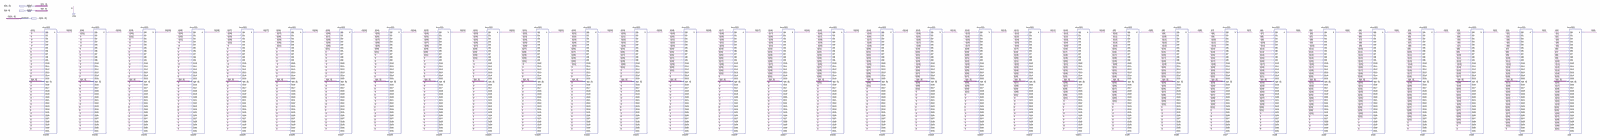
[diagram p0: schematic sheet, whole]
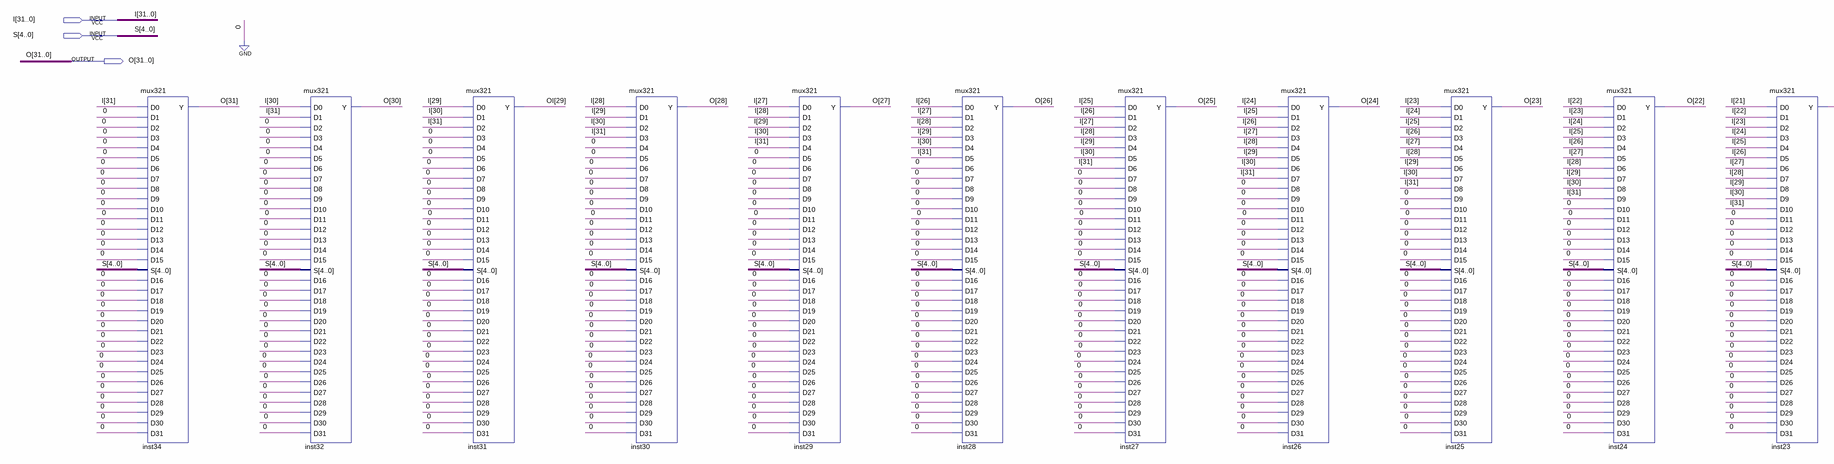
[diagram p1: schematic sheet, left part]
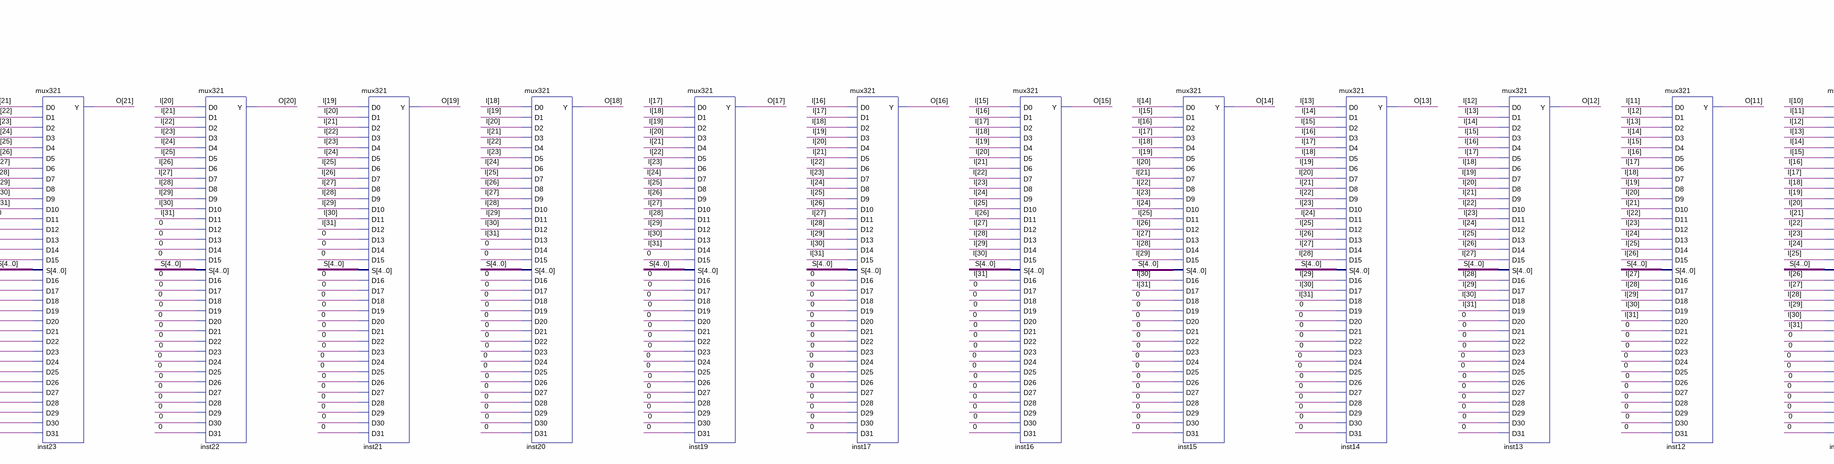
[diagram p2: schematic sheet, centre part]
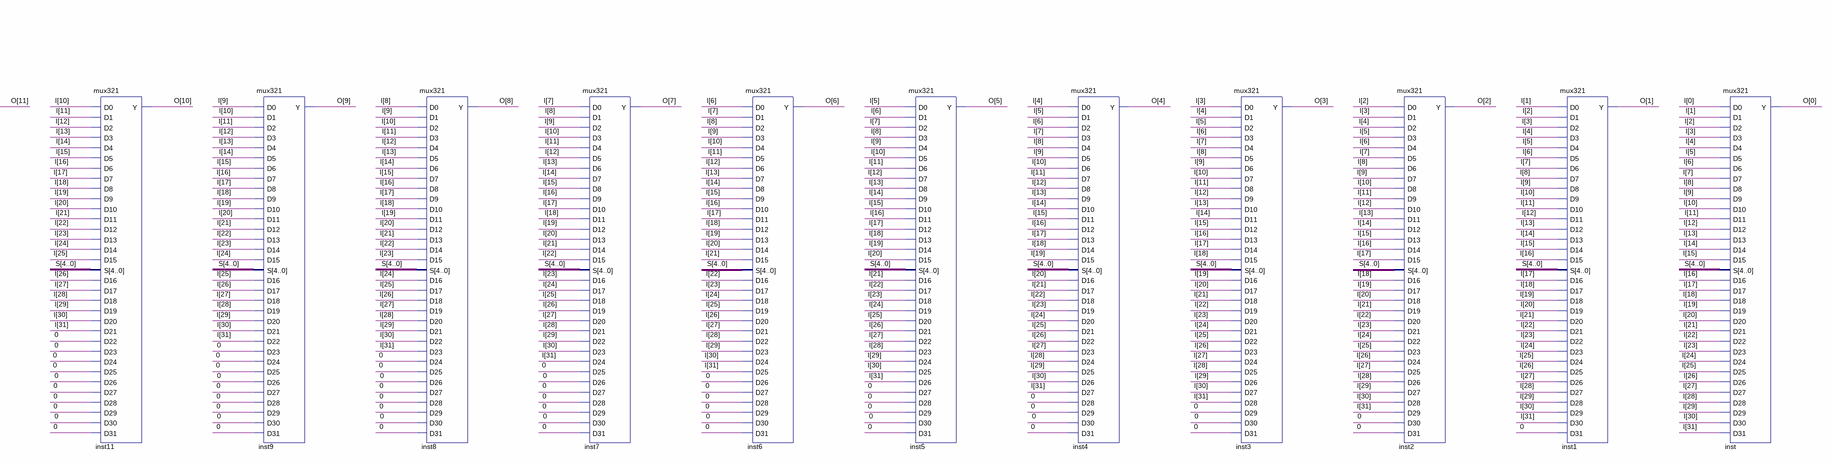
[diagram p3: schematic sheet, right part]
// Quartus schematic Shift_Right_32b.bdf as structural Verilog: 32 symbols, 3 pins
module Shift_Right_32b (
  input  [31:0] I,
  input  [4:0] S,
  output [31:0] O
);

  wire [29:29] OI;

  mux321 inst34 (
    .D0(I[31]), .D1(1'b0), .D2(1'b0), .D3(1'b0), .D4(1'b0), .D5(1'b0), .D6(1'b0), .D7(1'b0), .D8(1'b0),
    .D9(1'b0), .D10(1'b0), .D11(1'b0), .D12(1'b0), .D13(1'b0), .D14(1'b0), .D15(1'b0), .S(S), .D16(1'b0),
    .D17(1'b0), .D18(1'b0), .D19(1'b0), .D20(1'b0), .D21(1'b0), .D22(1'b0), .D23(1'b0), .D24(1'b0),
    .D25(1'b0), .D26(1'b0), .D27(1'b0), .D28(1'b0), .D29(1'b0), .D30(1'b0), .D31(1'b0), .Y(O[31]));
  mux321 inst32 (
    .D0(I[30]), .D1(I[31]), .D2(1'b0), .D3(1'b0), .D4(1'b0), .D5(1'b0), .D6(1'b0), .D7(1'b0), .D8(1'b0),
    .D9(1'b0), .D10(1'b0), .D11(1'b0), .D12(1'b0), .D13(1'b0), .D14(1'b0), .D15(1'b0), .S(S), .D16(1'b0),
    .D17(1'b0), .D18(1'b0), .D19(1'b0), .D20(1'b0), .D21(1'b0), .D22(1'b0), .D23(1'b0), .D24(1'b0),
    .D25(1'b0), .D26(1'b0), .D27(1'b0), .D28(1'b0), .D29(1'b0), .D30(1'b0), .D31(1'b0), .Y(O[30]));
  mux321 inst31 (
    .D0(I[29]), .D1(I[30]), .D2(I[31]), .D3(1'b0), .D4(1'b0), .D5(1'b0), .D6(1'b0), .D7(1'b0), .D8(1'b0),
    .D9(1'b0), .D10(1'b0), .D11(1'b0), .D12(1'b0), .D13(1'b0), .D14(1'b0), .D15(1'b0), .S(S), .D16(1'b0),
    .D17(1'b0), .D18(1'b0), .D19(1'b0), .D20(1'b0), .D21(1'b0), .D22(1'b0), .D23(1'b0), .D24(1'b0),
    .D25(1'b0), .D26(1'b0), .D27(1'b0), .D28(1'b0), .D29(1'b0), .D30(1'b0), .D31(1'b0), .Y(OI[29]));
  mux321 inst30 (
    .D0(I[28]), .D1(I[29]), .D2(I[30]), .D3(I[31]), .D4(1'b0), .D5(1'b0), .D6(1'b0), .D7(1'b0), .D8(1'b0),
    .D9(1'b0), .D10(1'b0), .D11(1'b0), .D12(1'b0), .D13(1'b0), .D14(1'b0), .D15(1'b0), .S(S), .D16(1'b0),
    .D17(1'b0), .D18(1'b0), .D19(1'b0), .D20(1'b0), .D21(1'b0), .D22(1'b0), .D23(1'b0), .D24(1'b0),
    .D25(1'b0), .D26(1'b0), .D27(1'b0), .D28(1'b0), .D29(1'b0), .D30(1'b0), .D31(1'b0), .Y(O[28]));
  mux321 inst29 (
    .D0(I[27]), .D1(I[28]), .D2(I[29]), .D3(I[30]), .D4(I[31]), .D5(1'b0), .D6(1'b0), .D7(1'b0), .D8(1'b0),
    .D9(1'b0), .D10(1'b0), .D11(1'b0), .D12(1'b0), .D13(1'b0), .D14(1'b0), .D15(1'b0), .S(S), .D16(1'b0),
    .D17(1'b0), .D18(1'b0), .D19(1'b0), .D20(1'b0), .D21(1'b0), .D22(1'b0), .D23(1'b0), .D24(1'b0),
    .D25(1'b0), .D26(1'b0), .D27(1'b0), .D28(1'b0), .D29(1'b0), .D30(1'b0), .D31(1'b0), .Y(O[27]));
  mux321 inst28 (
    .D0(I[26]), .D1(I[27]), .D2(I[28]), .D3(I[29]), .D4(I[30]), .D5(I[31]), .D6(1'b0), .D7(1'b0), .D8(1'b0),
    .D9(1'b0), .D10(1'b0), .D11(1'b0), .D12(1'b0), .D13(1'b0), .D14(1'b0), .D15(1'b0), .S(S), .D16(1'b0),
    .D17(1'b0), .D18(1'b0), .D19(1'b0), .D20(1'b0), .D21(1'b0), .D22(1'b0), .D23(1'b0), .D24(1'b0),
    .D25(1'b0), .D26(1'b0), .D27(1'b0), .D28(1'b0), .D29(1'b0), .D30(1'b0), .D31(1'b0), .Y(O[26]));
  mux321 inst27 (
    .D0(I[25]), .D1(I[26]), .D2(I[27]), .D3(I[28]), .D4(I[29]), .D5(I[30]), .D6(I[31]), .D7(1'b0), .D8(1'b0),
    .D9(1'b0), .D10(1'b0), .D11(1'b0), .D12(1'b0), .D13(1'b0), .D14(1'b0), .D15(1'b0), .S(S), .D16(1'b0),
    .D17(1'b0), .D18(1'b0), .D19(1'b0), .D20(1'b0), .D21(1'b0), .D22(1'b0), .D23(1'b0), .D24(1'b0),
    .D25(1'b0), .D26(1'b0), .D27(1'b0), .D28(1'b0), .D29(1'b0), .D30(1'b0), .D31(1'b0), .Y(O[25]));
  mux321 inst26 (
    .D0(I[24]), .D1(I[25]), .D2(I[26]), .D3(I[27]), .D4(I[28]), .D5(I[29]), .D6(I[30]), .D7(I[31]),
    .D8(1'b0), .D9(1'b0), .D10(1'b0), .D11(1'b0), .D12(1'b0), .D13(1'b0), .D14(1'b0), .D15(1'b0), .S(S),
    .D16(1'b0), .D17(1'b0), .D18(1'b0), .D19(1'b0), .D20(1'b0), .D21(1'b0), .D22(1'b0), .D23(1'b0),
    .D24(1'b0), .D25(1'b0), .D26(1'b0), .D27(1'b0), .D28(1'b0), .D29(1'b0), .D30(1'b0), .D31(1'b0), .Y(O[24]));
  mux321 inst25 (
    .D0(I[23]), .D1(I[24]), .D2(I[25]), .D3(I[26]), .D4(I[27]), .D5(I[28]), .D6(I[29]), .D7(I[30]),
    .D8(I[31]), .D9(1'b0), .D10(1'b0), .D11(1'b0), .D12(1'b0), .D13(1'b0), .D14(1'b0), .D15(1'b0), .S(S),
    .D16(1'b0), .D17(1'b0), .D18(1'b0), .D19(1'b0), .D20(1'b0), .D21(1'b0), .D22(1'b0), .D23(1'b0),
    .D24(1'b0), .D25(1'b0), .D26(1'b0), .D27(1'b0), .D28(1'b0), .D29(1'b0), .D30(1'b0), .D31(1'b0), .Y(O[23]));
  mux321 inst24 (
    .D0(I[22]), .D1(I[23]), .D2(I[24]), .D3(I[25]), .D4(I[26]), .D5(I[27]), .D6(I[28]), .D7(I[29]),
    .D8(I[30]), .D9(I[31]), .D10(1'b0), .D11(1'b0), .D12(1'b0), .D13(1'b0), .D14(1'b0), .D15(1'b0), .S(S),
    .D16(1'b0), .D17(1'b0), .D18(1'b0), .D19(1'b0), .D20(1'b0), .D21(1'b0), .D22(1'b0), .D23(1'b0),
    .D24(1'b0), .D25(1'b0), .D26(1'b0), .D27(1'b0), .D28(1'b0), .D29(1'b0), .D30(1'b0), .D31(1'b0), .Y(O[22]));
  mux321 inst23 (
    .D0(I[21]), .D1(I[22]), .D2(I[23]), .D3(I[24]), .D4(I[25]), .D5(I[26]), .D6(I[27]), .D7(I[28]),
    .D8(I[29]), .D9(I[30]), .D10(I[31]), .D11(1'b0), .D12(1'b0), .D13(1'b0), .D14(1'b0), .D15(1'b0), .S(S),
    .D16(1'b0), .D17(1'b0), .D18(1'b0), .D19(1'b0), .D20(1'b0), .D21(1'b0), .D22(1'b0), .D23(1'b0),
    .D24(1'b0), .D25(1'b0), .D26(1'b0), .D27(1'b0), .D28(1'b0), .D29(1'b0), .D30(1'b0), .D31(1'b0), .Y(O[21]));
  mux321 inst22 (
    .D0(I[20]), .D1(I[21]), .D2(I[22]), .D3(I[23]), .D4(I[24]), .D5(I[25]), .D6(I[26]), .D7(I[27]),
    .D8(I[28]), .D9(I[29]), .D10(I[30]), .D11(I[31]), .D12(1'b0), .D13(1'b0), .D14(1'b0), .D15(1'b0), .S(S),
    .D16(1'b0), .D17(1'b0), .D18(1'b0), .D19(1'b0), .D20(1'b0), .D21(1'b0), .D22(1'b0), .D23(1'b0),
    .D24(1'b0), .D25(1'b0), .D26(1'b0), .D27(1'b0), .D28(1'b0), .D29(1'b0), .D30(1'b0), .D31(1'b0), .Y(O[20]));
  mux321 inst21 (
    .D0(I[19]), .D1(I[20]), .D2(I[21]), .D3(I[22]), .D4(I[23]), .D5(I[24]), .D6(I[25]), .D7(I[26]),
    .D8(I[27]), .D9(I[28]), .D10(I[29]), .D11(I[30]), .D12(I[31]), .D13(1'b0), .D14(1'b0), .D15(1'b0), .S(S),
    .D16(1'b0), .D17(1'b0), .D18(1'b0), .D19(1'b0), .D20(1'b0), .D21(1'b0), .D22(1'b0), .D23(1'b0),
    .D24(1'b0), .D25(1'b0), .D26(1'b0), .D27(1'b0), .D28(1'b0), .D29(1'b0), .D30(1'b0), .D31(1'b0), .Y(O[19]));
  mux321 inst20 (
    .D0(I[18]), .D1(I[19]), .D2(I[20]), .D3(I[21]), .D4(I[22]), .D5(I[23]), .D6(I[24]), .D7(I[25]),
    .D8(I[26]), .D9(I[27]), .D10(I[28]), .D11(I[29]), .D12(I[30]), .D13(I[31]), .D14(1'b0), .D15(1'b0),
    .S(S), .D16(1'b0), .D17(1'b0), .D18(1'b0), .D19(1'b0), .D20(1'b0), .D21(1'b0), .D22(1'b0), .D23(1'b0),
    .D24(1'b0), .D25(1'b0), .D26(1'b0), .D27(1'b0), .D28(1'b0), .D29(1'b0), .D30(1'b0), .D31(1'b0), .Y(O[18]));
  mux321 inst19 (
    .D0(I[17]), .D1(I[18]), .D2(I[19]), .D3(I[20]), .D4(I[21]), .D5(I[22]), .D6(I[23]), .D7(I[24]),
    .D8(I[25]), .D9(I[26]), .D10(I[27]), .D11(I[28]), .D12(I[29]), .D13(I[30]), .D14(I[31]), .D15(1'b0),
    .S(S), .D16(1'b0), .D17(1'b0), .D18(1'b0), .D19(1'b0), .D20(1'b0), .D21(1'b0), .D22(1'b0), .D23(1'b0),
    .D24(1'b0), .D25(1'b0), .D26(1'b0), .D27(1'b0), .D28(1'b0), .D29(1'b0), .D30(1'b0), .D31(1'b0), .Y(O[17]));
  mux321 inst17 (
    .D0(I[16]), .D1(I[17]), .D2(I[18]), .D3(I[19]), .D4(I[20]), .D5(I[21]), .D6(I[22]), .D7(I[23]),
    .D8(I[24]), .D9(I[25]), .D10(I[26]), .D11(I[27]), .D12(I[28]), .D13(I[29]), .D14(I[30]), .D15(I[31]),
    .S(S), .D16(1'b0), .D17(1'b0), .D18(1'b0), .D19(1'b0), .D20(1'b0), .D21(1'b0), .D22(1'b0), .D23(1'b0),
    .D24(1'b0), .D25(1'b0), .D26(1'b0), .D27(1'b0), .D28(1'b0), .D29(1'b0), .D30(1'b0), .D31(1'b0), .Y(O[16]));
  mux321 inst16 (
    .D0(I[15]), .D1(I[16]), .D2(I[17]), .D3(I[18]), .D4(I[19]), .D5(I[20]), .D6(I[21]), .D7(I[22]),
    .D8(I[23]), .D9(I[24]), .D10(I[25]), .D11(I[26]), .D12(I[27]), .D13(I[28]), .D14(I[29]), .D15(I[30]),
    .S(S), .D16(I[31]), .D17(1'b0), .D18(1'b0), .D19(1'b0), .D20(1'b0), .D21(1'b0), .D22(1'b0), .D23(1'b0),
    .D24(1'b0), .D25(1'b0), .D26(1'b0), .D27(1'b0), .D28(1'b0), .D29(1'b0), .D30(1'b0), .D31(1'b0), .Y(O[15]));
  mux321 inst15 (
    .D0(I[14]), .D1(I[15]), .D2(I[16]), .D3(I[17]), .D4(I[18]), .D5(I[19]), .D6(I[20]), .D7(I[21]),
    .D8(I[22]), .D9(I[23]), .D10(I[24]), .D11(I[25]), .D12(I[26]), .D13(I[27]), .D14(I[28]), .D15(I[29]),
    .S(S), .D16(I[30]), .D17(I[31]), .D18(1'b0), .D19(1'b0), .D20(1'b0), .D21(1'b0), .D22(1'b0), .D23(1'b0),
    .D24(1'b0), .D25(1'b0), .D26(1'b0), .D27(1'b0), .D28(1'b0), .D29(1'b0), .D30(1'b0), .D31(1'b0), .Y(O[14]));
  mux321 inst14 (
    .D0(I[13]), .D1(I[14]), .D2(I[15]), .D3(I[16]), .D4(I[17]), .D5(I[18]), .D6(I[19]), .D7(I[20]),
    .D8(I[21]), .D9(I[22]), .D10(I[23]), .D11(I[24]), .D12(I[25]), .D13(I[26]), .D14(I[27]), .D15(I[28]),
    .S(S), .D16(I[29]), .D17(I[30]), .D18(I[31]), .D19(1'b0), .D20(1'b0), .D21(1'b0), .D22(1'b0), .D23(1'b0),
    .D24(1'b0), .D25(1'b0), .D26(1'b0), .D27(1'b0), .D28(1'b0), .D29(1'b0), .D30(1'b0), .D31(1'b0), .Y(O[13]));
  mux321 inst13 (
    .D0(I[12]), .D1(I[13]), .D2(I[14]), .D3(I[15]), .D4(I[16]), .D5(I[17]), .D6(I[18]), .D7(I[19]),
    .D8(I[20]), .D9(I[21]), .D10(I[22]), .D11(I[23]), .D12(I[24]), .D13(I[25]), .D14(I[26]), .D15(I[27]),
    .S(S), .D16(I[28]), .D17(I[29]), .D18(I[30]), .D19(I[31]), .D20(1'b0), .D21(1'b0), .D22(1'b0),
    .D23(1'b0), .D24(1'b0), .D25(1'b0), .D26(1'b0), .D27(1'b0), .D28(1'b0), .D29(1'b0), .D30(1'b0),
    .D31(1'b0), .Y(O[12]));
  mux321 inst12 (
    .D0(I[11]), .D1(I[12]), .D2(I[13]), .D3(I[14]), .D4(I[15]), .D5(I[16]), .D6(I[17]), .D7(I[18]),
    .D8(I[19]), .D9(I[20]), .D10(I[21]), .D11(I[22]), .D12(I[23]), .D13(I[24]), .D14(I[25]), .D15(I[26]),
    .S(S), .D16(I[27]), .D17(I[28]), .D18(I[29]), .D19(I[30]), .D20(I[31]), .D21(1'b0), .D22(1'b0),
    .D23(1'b0), .D24(1'b0), .D25(1'b0), .D26(1'b0), .D27(1'b0), .D28(1'b0), .D29(1'b0), .D30(1'b0),
    .D31(1'b0), .Y(O[11]));
  mux321 inst11 (
    .D0(I[10]), .D1(I[11]), .D2(I[12]), .D3(I[13]), .D4(I[14]), .D5(I[15]), .D6(I[16]), .D7(I[17]),
    .D8(I[18]), .D9(I[19]), .D10(I[20]), .D11(I[21]), .D12(I[22]), .D13(I[23]), .D14(I[24]), .D15(I[25]),
    .S(S), .D16(I[26]), .D17(I[27]), .D18(I[28]), .D19(I[29]), .D20(I[30]), .D21(I[31]), .D22(1'b0),
    .D23(1'b0), .D24(1'b0), .D25(1'b0), .D26(1'b0), .D27(1'b0), .D28(1'b0), .D29(1'b0), .D30(1'b0),
    .D31(1'b0), .Y(O[10]));
  mux321 inst9 (
    .D0(I[9]), .D1(I[10]), .D2(I[11]), .D3(I[12]), .D4(I[13]), .D5(I[14]), .D6(I[15]), .D7(I[16]),
    .D8(I[17]), .D9(I[18]), .D10(I[19]), .D11(I[20]), .D12(I[21]), .D13(I[22]), .D14(I[23]), .D15(I[24]),
    .S(S), .D16(I[25]), .D17(I[26]), .D18(I[27]), .D19(I[28]), .D20(I[29]), .D21(I[30]), .D22(I[31]),
    .D23(1'b0), .D24(1'b0), .D25(1'b0), .D26(1'b0), .D27(1'b0), .D28(1'b0), .D29(1'b0), .D30(1'b0),
    .D31(1'b0), .Y(O[9]));
  mux321 inst8 (
    .D0(I[8]), .D1(I[9]), .D2(I[10]), .D3(I[11]), .D4(I[12]), .D5(I[13]), .D6(I[14]), .D7(I[15]), .D8(I[16]),
    .D9(I[17]), .D10(I[18]), .D11(I[19]), .D12(I[20]), .D13(I[21]), .D14(I[22]), .D15(I[23]), .S(S),
    .D16(I[24]), .D17(I[25]), .D18(I[26]), .D19(I[27]), .D20(I[28]), .D21(I[29]), .D22(I[30]), .D23(I[31]),
    .D24(1'b0), .D25(1'b0), .D26(1'b0), .D27(1'b0), .D28(1'b0), .D29(1'b0), .D30(1'b0), .D31(1'b0), .Y(O[8]));
  mux321 inst7 (
    .D0(I[7]), .D1(I[8]), .D2(I[9]), .D3(I[10]), .D4(I[11]), .D5(I[12]), .D6(I[13]), .D7(I[14]), .D8(I[15]),
    .D9(I[16]), .D10(I[17]), .D11(I[18]), .D12(I[19]), .D13(I[20]), .D14(I[21]), .D15(I[22]), .S(S),
    .D16(I[23]), .D17(I[24]), .D18(I[25]), .D19(I[26]), .D20(I[27]), .D21(I[28]), .D22(I[29]), .D23(I[30]),
    .D24(I[31]), .D25(1'b0), .D26(1'b0), .D27(1'b0), .D28(1'b0), .D29(1'b0), .D30(1'b0), .D31(1'b0), .Y(O[7]));
  mux321 inst6 (
    .D0(I[6]), .D1(I[7]), .D2(I[8]), .D3(I[9]), .D4(I[10]), .D5(I[11]), .D6(I[12]), .D7(I[13]), .D8(I[14]),
    .D9(I[15]), .D10(I[16]), .D11(I[17]), .D12(I[18]), .D13(I[19]), .D14(I[20]), .D15(I[21]), .S(S),
    .D16(I[22]), .D17(I[23]), .D18(I[24]), .D19(I[25]), .D20(I[26]), .D21(I[27]), .D22(I[28]), .D23(I[29]),
    .D24(I[30]), .D25(I[31]), .D26(1'b0), .D27(1'b0), .D28(1'b0), .D29(1'b0), .D30(1'b0), .D31(1'b0), .Y(O[6]));
  mux321 inst5 (
    .D0(I[5]), .D1(I[6]), .D2(I[7]), .D3(I[8]), .D4(I[9]), .D5(I[10]), .D6(I[11]), .D7(I[12]), .D8(I[13]),
    .D9(I[14]), .D10(I[15]), .D11(I[16]), .D12(I[17]), .D13(I[18]), .D14(I[19]), .D15(I[20]), .S(S),
    .D16(I[21]), .D17(I[22]), .D18(I[23]), .D19(I[24]), .D20(I[25]), .D21(I[26]), .D22(I[27]), .D23(I[28]),
    .D24(I[29]), .D25(I[30]), .D26(I[31]), .D27(1'b0), .D28(1'b0), .D29(1'b0), .D30(1'b0), .D31(1'b0),
    .Y(O[5]));
  mux321 inst4 (
    .D0(I[4]), .D1(I[5]), .D2(I[6]), .D3(I[7]), .D4(I[8]), .D5(I[9]), .D6(I[10]), .D7(I[11]), .D8(I[12]),
    .D9(I[13]), .D10(I[14]), .D11(I[15]), .D12(I[16]), .D13(I[17]), .D14(I[18]), .D15(I[19]), .S(S),
    .D16(I[20]), .D17(I[21]), .D18(I[22]), .D19(I[23]), .D20(I[24]), .D21(I[25]), .D22(I[26]), .D23(I[27]),
    .D24(I[28]), .D25(I[29]), .D26(I[30]), .D27(I[31]), .D28(1'b0), .D29(1'b0), .D30(1'b0), .D31(1'b0),
    .Y(O[4]));
  mux321 inst3 (
    .D0(I[3]), .D1(I[4]), .D2(I[5]), .D3(I[6]), .D4(I[7]), .D5(I[8]), .D6(I[9]), .D7(I[10]), .D8(I[11]),
    .D9(I[12]), .D10(I[13]), .D11(I[14]), .D12(I[15]), .D13(I[16]), .D14(I[17]), .D15(I[18]), .S(S),
    .D16(I[19]), .D17(I[20]), .D18(I[21]), .D19(I[22]), .D20(I[23]), .D21(I[24]), .D22(I[25]), .D23(I[26]),
    .D24(I[27]), .D25(I[28]), .D26(I[29]), .D27(I[30]), .D28(I[31]), .D29(1'b0), .D30(1'b0), .D31(1'b0),
    .Y(O[3]));
  mux321 inst2 (
    .D0(I[2]), .D1(I[3]), .D2(I[4]), .D3(I[5]), .D4(I[6]), .D5(I[7]), .D6(I[8]), .D7(I[9]), .D8(I[10]),
    .D9(I[11]), .D10(I[12]), .D11(I[13]), .D12(I[14]), .D13(I[15]), .D14(I[16]), .D15(I[17]), .S(S),
    .D16(I[18]), .D17(I[19]), .D18(I[20]), .D19(I[21]), .D20(I[22]), .D21(I[23]), .D22(I[24]), .D23(I[25]),
    .D24(I[26]), .D25(I[27]), .D26(I[28]), .D27(I[29]), .D28(I[30]), .D29(I[31]), .D30(1'b0), .D31(1'b0),
    .Y(O[2]));
  mux321 inst1 (
    .D0(I[1]), .D1(I[2]), .D2(I[3]), .D3(I[4]), .D4(I[5]), .D5(I[6]), .D6(I[7]), .D7(I[8]), .D8(I[9]),
    .D9(I[10]), .D10(I[11]), .D11(I[12]), .D12(I[13]), .D13(I[14]), .D14(I[15]), .D15(I[16]), .S(S),
    .D16(I[17]), .D17(I[18]), .D18(I[19]), .D19(I[20]), .D20(I[21]), .D21(I[22]), .D22(I[23]), .D23(I[24]),
    .D24(I[25]), .D25(I[26]), .D26(I[27]), .D27(I[28]), .D28(I[29]), .D29(I[30]), .D30(I[31]), .D31(1'b0),
    .Y(O[1]));
  mux321 inst (
    .D0(I[0]), .D1(I[1]), .D2(I[2]), .D3(I[3]), .D4(I[4]), .D5(I[5]), .D6(I[6]), .D7(I[7]), .D8(I[8]),
    .D9(I[9]), .D10(I[10]), .D11(I[11]), .D12(I[12]), .D13(I[13]), .D14(I[14]), .D15(I[15]), .S(S),
    .D16(I[16]), .D17(I[17]), .D18(I[18]), .D19(I[19]), .D20(I[20]), .D21(I[21]), .D22(I[22]), .D23(I[23]),
    .D24(I[24]), .D25(I[25]), .D26(I[26]), .D27(I[27]), .D28(I[28]), .D29(I[29]), .D30(I[30]), .D31(I[31]),
    .Y(O[0]));
endmodule
